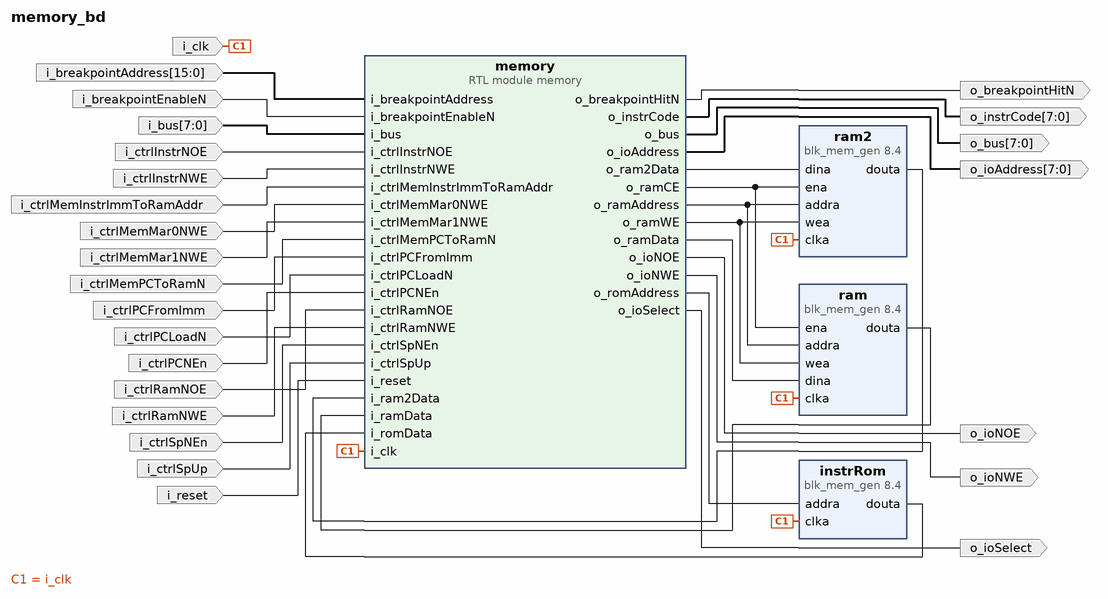
[diagram p0: block diagram of the top level]
# Vivado block design memory_bd, xc7a100tcsg324-3, Vivado 2021.1
create_bd_design memory_bd

create_bd_port -dir I -type clk i_clk
create_bd_port -dir I i_ctrlInstrNWE
create_bd_port -dir I i_ctrlRamNOE
create_bd_port -dir I i_ctrlRamNWE
create_bd_port -dir I -type rst i_reset
create_bd_port -dir O -from 7 -to 0 o_instrCode
create_bd_port -dir I i_ctrlMemMar0NWE
create_bd_port -dir I i_ctrlMemMar1NWE
create_bd_port -dir I i_ctrlPCLoadN
create_bd_port -dir I i_ctrlSpNEn
create_bd_port -dir I i_ctrlInstrNOE
create_bd_port -dir I i_ctrlSpUp
create_bd_port -dir I -from 7 -to 0 i_bus
create_bd_port -dir O -from 7 -to 0 o_bus
create_bd_port -dir I -from 15 -to 0 i_breakpointAddress
create_bd_port -dir I i_breakpointEnableN
create_bd_port -dir O o_breakpointHitN
create_bd_port -dir I i_ctrlPCNEn
create_bd_port -dir O o_ioSelect
create_bd_port -dir O -from 7 -to 0 o_ioAddress
create_bd_port -dir O o_ioNOE
create_bd_port -dir O o_ioNWE
create_bd_port -dir I i_ctrlPCFromImm
create_bd_port -dir I i_ctrlMemPCToRamN
create_bd_port -dir I i_ctrlMemInstrImmToRamAddr

create_bd_cell -type ip -vlnv xilinx.com:ip:blk_mem_gen:8.4 ram
set_property -dict [list \
  CONFIG.Enable_32bit_Address false \
  CONFIG.Enable_A Use_ENA_Pin \
  CONFIG.Read_Width_A 8 \
  CONFIG.Register_PortA_Output_of_Memory_Primitives false \
  CONFIG.Use_Byte_Write_Enable false \
  CONFIG.Use_RSTA_Pin false \
  CONFIG.Write_Depth_A 131072 \
  CONFIG.Write_Width_A 8 \
  CONFIG.use_bram_block Stand_Alone \
] [get_bd_cells ram]
create_bd_cell -type ip -vlnv xilinx.com:ip:blk_mem_gen:8.4 instrRom
set_property -dict [list \
  CONFIG.Coe_File ../../../../../../../instructionRom.coe \
  CONFIG.Enable_32bit_Address false \
  CONFIG.Enable_A Always_Enabled \
  CONFIG.Fill_Remaining_Memory_Locations true \
  CONFIG.Load_Init_File true \
  CONFIG.Memory_Type Single_Port_ROM \
  CONFIG.Port_A_Write_Rate 0 \
  CONFIG.Register_PortA_Output_of_Memory_Primitives false \
  CONFIG.Remaining_Memory_Locations ffffff \
  CONFIG.Use_RSTA_Pin false \
  CONFIG.Write_Depth_A 32768 \
  CONFIG.Write_Width_A 24 \
  CONFIG.use_bram_block Stand_Alone \
] [get_bd_cells instrRom]
create_bd_cell -type ip -vlnv xilinx.com:ip:blk_mem_gen:8.4 ram2
set_property -dict [list \
  CONFIG.Enable_32bit_Address false \
  CONFIG.Enable_A Use_ENA_Pin \
  CONFIG.Read_Width_A 8 \
  CONFIG.Register_PortA_Output_of_Memory_Primitives false \
  CONFIG.Use_Byte_Write_Enable false \
  CONFIG.Use_RSTA_Pin false \
  CONFIG.Write_Depth_A 131072 \
  CONFIG.Write_Width_A 8 \
  CONFIG.use_bram_block Stand_Alone \
] [get_bd_cells ram2]
create_bd_cell -type module -reference memory memory

# ---- connections ----

connect_bd_net [get_bd_pins memory/o_ramCE] [get_bd_pins ram/ena] [get_bd_pins ram2/ena]
connect_bd_net -net i_breakpointAddress_0_1 [get_bd_ports i_breakpointAddress] [get_bd_pins memory/i_breakpointAddress]
connect_bd_net -net i_breakpointEnableN_0_1 [get_bd_ports i_breakpointEnableN] [get_bd_pins memory/i_breakpointEnableN]
connect_bd_net -net i_bus_0_1 [get_bd_ports i_bus] [get_bd_pins memory/i_bus]
connect_bd_net -net i_clk_0_1 [get_bd_ports i_clk] \
  [get_bd_pins ram/clka] [get_bd_pins instrRom/clka] [get_bd_pins ram2/clka] [get_bd_pins memory/i_clk]
connect_bd_net -net i_ctrlInstrNOE_0_1 [get_bd_ports i_ctrlInstrNOE] [get_bd_pins memory/i_ctrlInstrNOE]
connect_bd_net -net i_ctrlInstrNWE_0_1 [get_bd_ports i_ctrlInstrNWE] [get_bd_pins memory/i_ctrlInstrNWE]
connect_bd_net -net i_ctrlMemInstrImmToRamAddr_0_1 [get_bd_ports i_ctrlMemInstrImmToRamAddr] [get_bd_pins memory/i_ctrlMemInstrImmToRamAddr]
connect_bd_net -net i_ctrlMemMar0NWE_0_1 [get_bd_ports i_ctrlMemMar0NWE] [get_bd_pins memory/i_ctrlMemMar0NWE]
connect_bd_net -net i_ctrlMemMar1NWE_0_1 [get_bd_ports i_ctrlMemMar1NWE] [get_bd_pins memory/i_ctrlMemMar1NWE]
connect_bd_net -net i_ctrlMemPCToRamN_0_1 [get_bd_ports i_ctrlMemPCToRamN] [get_bd_pins memory/i_ctrlMemPCToRamN]
connect_bd_net -net i_ctrlPCFromImm_0_1 [get_bd_ports i_ctrlPCFromImm] [get_bd_pins memory/i_ctrlPCFromImm]
connect_bd_net -net i_ctrlPCLoadN_0_1 [get_bd_ports i_ctrlPCLoadN] [get_bd_pins memory/i_ctrlPCLoadN]
connect_bd_net -net i_ctrlPCNEn_0_1 [get_bd_ports i_ctrlPCNEn] [get_bd_pins memory/i_ctrlPCNEn]
connect_bd_net -net i_ctrlRamNOE_0_1 [get_bd_ports i_ctrlRamNOE] [get_bd_pins memory/i_ctrlRamNOE]
connect_bd_net -net i_ctrlRamNWE_0_1 [get_bd_ports i_ctrlRamNWE] [get_bd_pins memory/i_ctrlRamNWE]
connect_bd_net -net i_ctrlSpNEn_0_1 [get_bd_ports i_ctrlSpNEn] [get_bd_pins memory/i_ctrlSpNEn]
connect_bd_net -net i_ctrlSpUp_0_1 [get_bd_ports i_ctrlSpUp] [get_bd_pins memory/i_ctrlSpUp]
connect_bd_net -net i_reset_0_1 [get_bd_ports i_reset] [get_bd_pins memory/i_reset]
connect_bd_net [get_bd_pins instrRom/douta] [get_bd_pins memory/i_romData]
connect_bd_net -net memory_0_o_instrCode [get_bd_pins memory/o_instrCode] [get_bd_ports o_instrCode]
connect_bd_net -net memory_0_o_ramAddress [get_bd_pins memory/o_ramAddress] [get_bd_pins ram/addra] [get_bd_pins ram2/addra]
connect_bd_net -net memory_0_o_ramData [get_bd_pins memory/o_ramData] [get_bd_pins ram/dina]
connect_bd_net -net memory_0_o_ramWE [get_bd_pins memory/o_ramWE] [get_bd_pins ram/wea] [get_bd_pins ram2/wea]
connect_bd_net -net memory_0_o_romAddress [get_bd_pins memory/o_romAddress] [get_bd_pins instrRom/addra]
connect_bd_net [get_bd_pins memory/o_breakpointHitN] [get_bd_ports o_breakpointHitN]
connect_bd_net [get_bd_pins memory/o_bus] [get_bd_ports o_bus]
connect_bd_net [get_bd_pins memory/o_ioAddress] [get_bd_ports o_ioAddress]
connect_bd_net [get_bd_pins memory/o_ioNOE] [get_bd_ports o_ioNOE]
connect_bd_net [get_bd_pins memory/o_ioNWE] [get_bd_ports o_ioNWE]
connect_bd_net [get_bd_pins memory/o_ioSelect] [get_bd_ports o_ioSelect]
connect_bd_net [get_bd_pins memory/o_ram2Data] [get_bd_pins ram2/dina]
connect_bd_net [get_bd_pins ram2/douta] [get_bd_pins memory/i_ram2Data]
connect_bd_net [get_bd_pins ram/douta] [get_bd_pins memory/i_ramData]

validate_bd_design
save_bd_design
